# EAGLE schematic rev_l_v8 (EAGLE 9.7.0)
AUTHOR: Pat Pannuto; REV: L; TITLE: TotTag

## Sheet 1 of 5: nRF8240
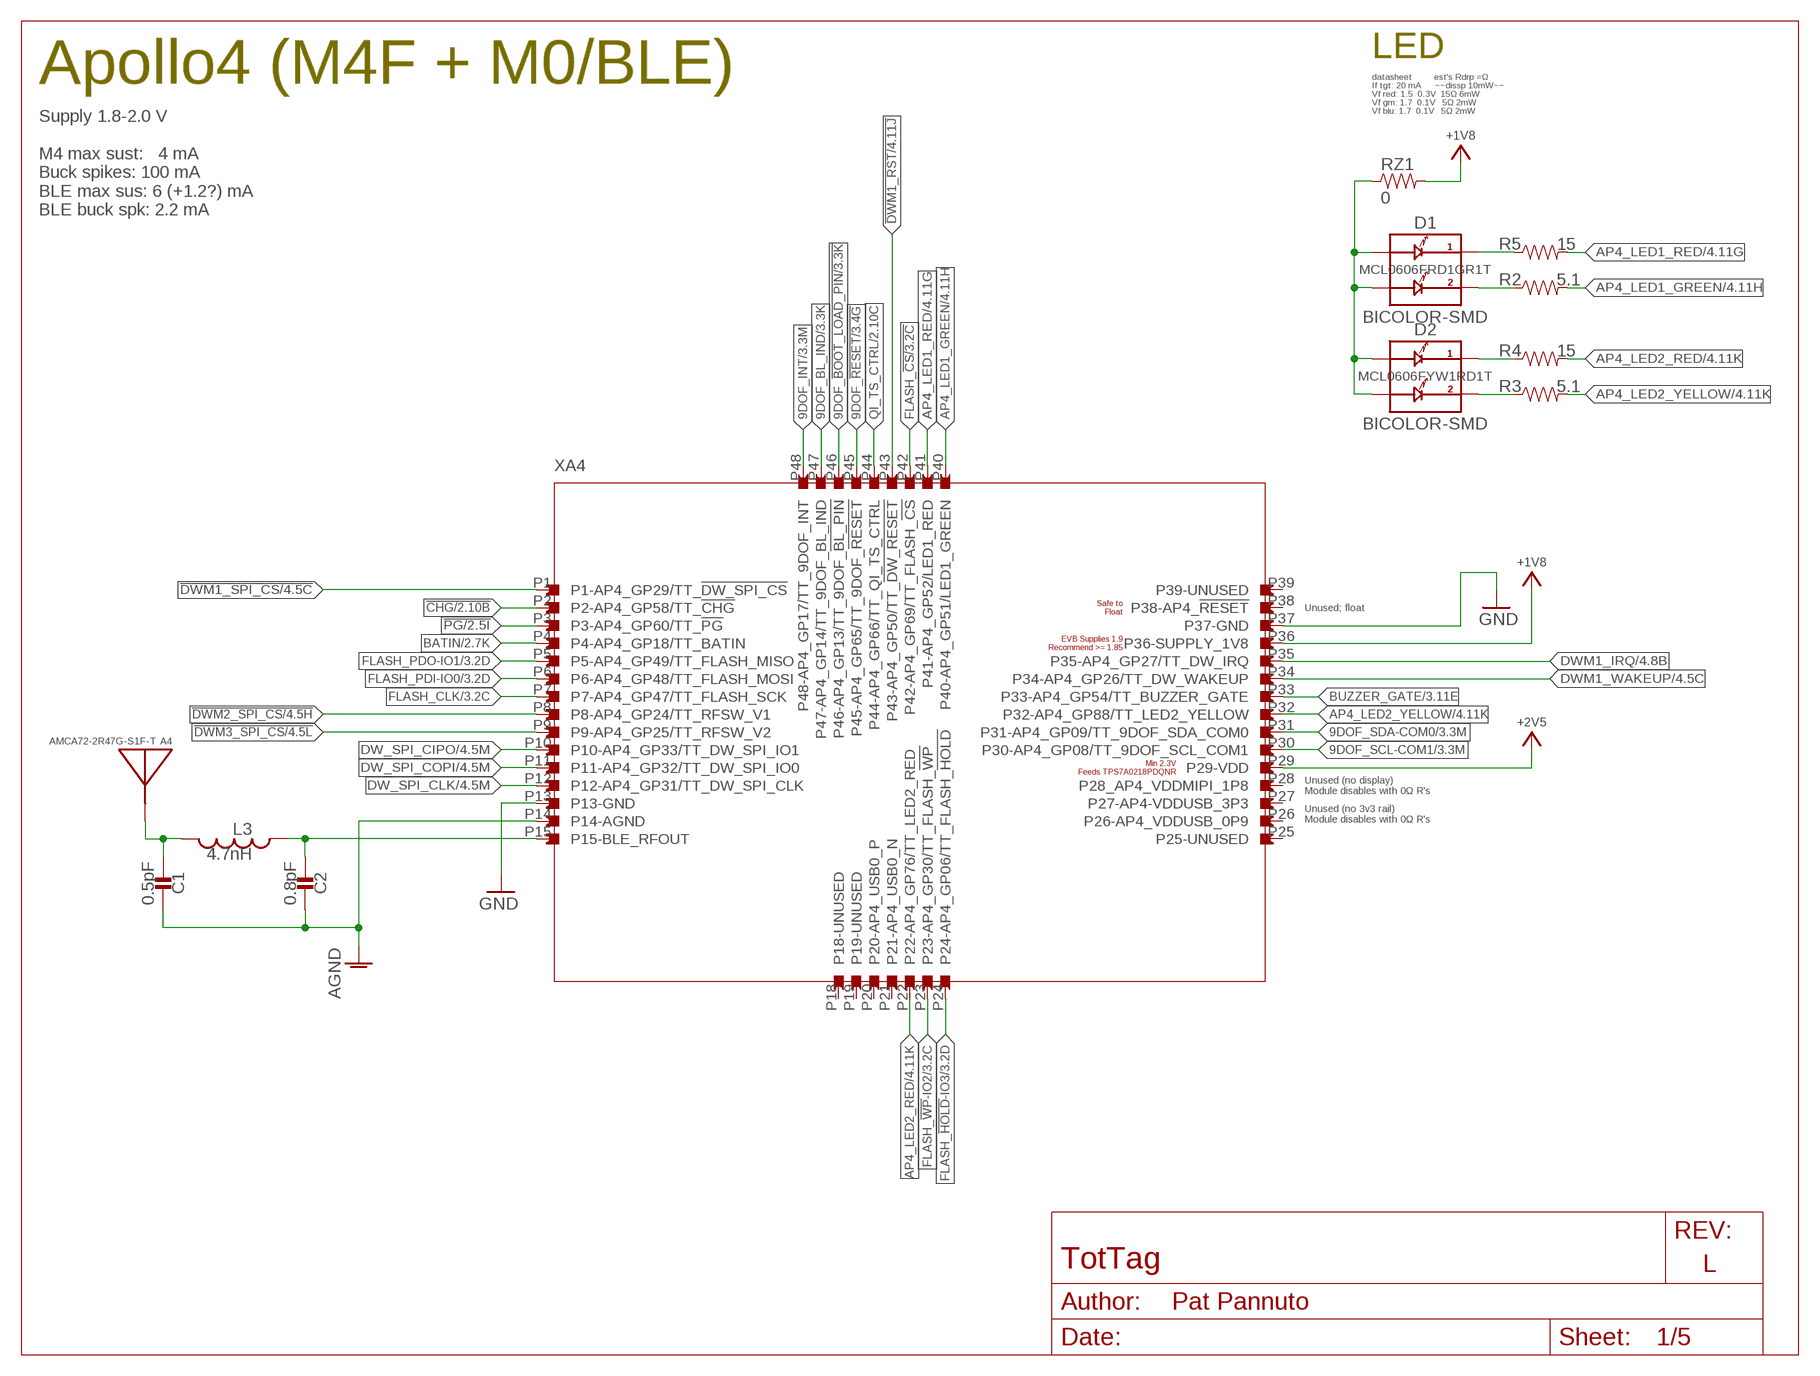
[diagram p0: schematic, sheet 1]

### Parts
A4  AMCA72-2R47G-S1F-T  [AMCA72-2R470G-S1F-T]
C1  0.5pF  CAPACITOR0402_CAP  [0402_CAP]
C2  0.8pF  CAPACITOR0402_CAP  [0402_CAP]
D1  BICOLOR-SMD  [LED-0606]
D2  BICOLOR-SMD  [LED-0606]
L3  4.7nH  INDUCTOR0402  [0402_CAP]
R2  5.1  RESISTOR0402_RES  [0402_RES]
R3  5.1  RESISTOR0402_RES  [0402_RES]
R4  15  RESISTOR0402_RES  [0402_RES]
R5  15  RESISTOR0402_RES  [0402_RES]
RZ1  0  RESISTOR0603_RES  [0603-RES]
XA4  APOLLO4_BLUEPLUS_MODULE  [APOLLO4_BLUEPLUS_MODULE]

### Nets
9DOF_!BOOT_LOAD_PIN: XA4.P46(P46-AP4_GP13/TT_9DOF_!BL_PIN) ; also sheet 3
9DOF_!RESET: XA4.P45(P45-AP4_GP65/TT_9DOF_!RESET) ; also sheet 3
9DOF_BL_IND: XA4.P47(P47-AP4_GP14/TT_9DOF_BL_IND) ; also sheet 3
9DOF_INT: XA4.P48(P48-AP4_GP17/TT_9DOF_INT) ; also sheet 3
9DOF_SCL-COM1: XA4.P30(P30-AP4_GP08/TT_9DOF_SCL_COM1) ; also sheet 3
9DOF_SDA-COM0: XA4.P31(P31-AP4_GP09/TT_9DOF_SDA_COM0) ; also sheet 3
!CHG: XA4.P2(P2-AP4_GP58/TT_!CHG) ; also sheet 2
!DWM1_RST: XA4.P43(P43-AP4_GP50/TT_!DW_RESET) ; also sheet 4
!DWM1_SPI_CS: XA4.P1(P1-AP4_GP29/TT_!DW_SPI_CS) ; also sheet 4
!DWM2_SPI_CS: XA4.P8(P8-AP4_GP24/TT_RFSW_V1) ; also sheet 4
!DWM3_SPI_CS: XA4.P9(P9-AP4_GP25/TT_RFSW_V2) ; also sheet 4
!PG: XA4.P3(P3-AP4_GP60/TT_!PG) ; also sheet 2
+1V8: RZ1.2 XA4.P36(P36-SUPPLY_1V8) ; also sheet 2,3,4
+2V5: XA4.P29(P29-VDD) ; also sheet 2,3,4
AGND [BLE_RF]: C1.2 C2.2 XA4.P14(P14-AGND)
AP4_LED1_GREEN: R2.2 XA4.P40(P40-AP4_GP51/LED1_GREEN) ; also sheet 4
AP4_LED1_RED: R5.2 XA4.P41(P41-AP4_GP52/LED1_RED) ; also sheet 4
AP4_LED2_BLUE_COMM: D1.C1 R5.1
AP4_LED2_RED: R4.2 XA4.P22(P22-AP4_GP76/TT_LED2_RED) ; also sheet 4
AP4_LED2_YELLOW: R3.2 XA4.P32(P32-AP4_GP88/TT_LED2_YELLOW) ; also sheet 4
AP4_LED_BLUE_COMM: D2.C2 R3.1
AP4_LED_GREEN_COMM: D2.C1 R4.1
AP4_LED_RED_COMM: D1.C2 R2.1
AP4_RFIOP [BLE_RF]: C2.1 L3.2 XA4.P15(P15-BLE_RFOUT)
BATIN: XA4.P4(P4-AP4_GP18/TT_BATIN) ; also sheet 2
BLE_ANT_FEED [BLE_RF]: A4.S1(ANTENNA) C1.1 L3.1
BUZZER_GATE: XA4.P33(P33-AP4_GP54/TT_BUZZER_GATE) ; also sheet 3
DW_SPI_CIPO: XA4.P10(P10-AP4_GP33/TT_DW_SPI_IO1) ; also sheet 4
DW_SPI_CLK: XA4.P12(P12-AP4_GP31/TT_DW_SPI_CLK) ; also sheet 4
DW_SPI_COPI: XA4.P11(P11-AP4_GP32/TT_DW_SPI_IO0) ; also sheet 4
DWM1_IRQ: XA4.P35(P35-AP4_GP27/TT_DW_IRQ) ; also sheet 4
DWM1_WAKEUP: XA4.P34(P34-AP4_GP26/TT_DW_WAKEUP) ; also sheet 4
FLASH_!CS: XA4.P42(P42-AP4_GP69/TT_FLASH_!CS) ; also sheet 3
FLASH_!HOLD!-IO3: XA4.P24(P24-AP4_GP06/TT_FLASH_!HOLD) ; also sheet 3
FLASH_!WP!-IO2: XA4.P23(P23-AP4_GP30/TT_FLASH_!WP) ; also sheet 3
FLASH_CLK: XA4.P7(P7-AP4_GP47/TT_FLASH_SCK) ; also sheet 3
FLASH_PDI-IO0: XA4.P6(P6-AP4_GP48/TT_FLASH_MOSI) ; also sheet 3
FLASH_PDO-IO1: XA4.P5(P5-AP4_GP49/TT_FLASH_MISO) ; also sheet 3
GND: XA4.P13(P13-GND) XA4.P37(P37-GND) ; also sheet 2,3,4
LED_SUP: D1.A1 D1.A2 D2.A1 D2.A2 RZ1.1
QI_TS_CTRL: XA4.P44(P44-AP4_GP66/TT_QI_TS_CTRL) ; also sheet 2
Unconnected: XA4.P18(P18-UNUSED) XA4.P19(P19-UNUSED) XA4.P20(P20-AP4_USB0_P) XA4.P21(P21-AP4_USB0_N) XA4.P25(P25-UNUSED) XA4.P26(P26-AP4_VDDUSB_0P9) XA4.P27(P27-AP4-VDDUSB_3P3) XA4.P28(P28_AP4_VDDMIPI_1P8) XA4.P38(P38-AP4_!RESET) XA4.P39(P39-UNUSED)

### Notes on the sheet
- Apollo4 (M4F + M0/BLE)
- LED
- datasheet          est's Rdrp =Ω
  If tgt: 20 mA      ~~dissp 10mW~~
  Vf red: 1.5  0.3V  15Ω 6mW
  Vf grn: 1.7  0.1V   5Ω 2mW
  Vf blu: 1.7  0.1V   5Ω 2mW
- Supply 1.8-2.0 V
  
  M4 max sust:   4 mA
  Buck spikes: 100 mA
  BLE max sus: 6 (+1.2?) mA
  BLE buck spk: 2.2 mA
- Unused; float
- Unused (no display)
  Module disables with 0Ω R's
- Unused (no 3v3 rail)
  Module disables with 0Ω R's

## Sheet 2 of 5: Power
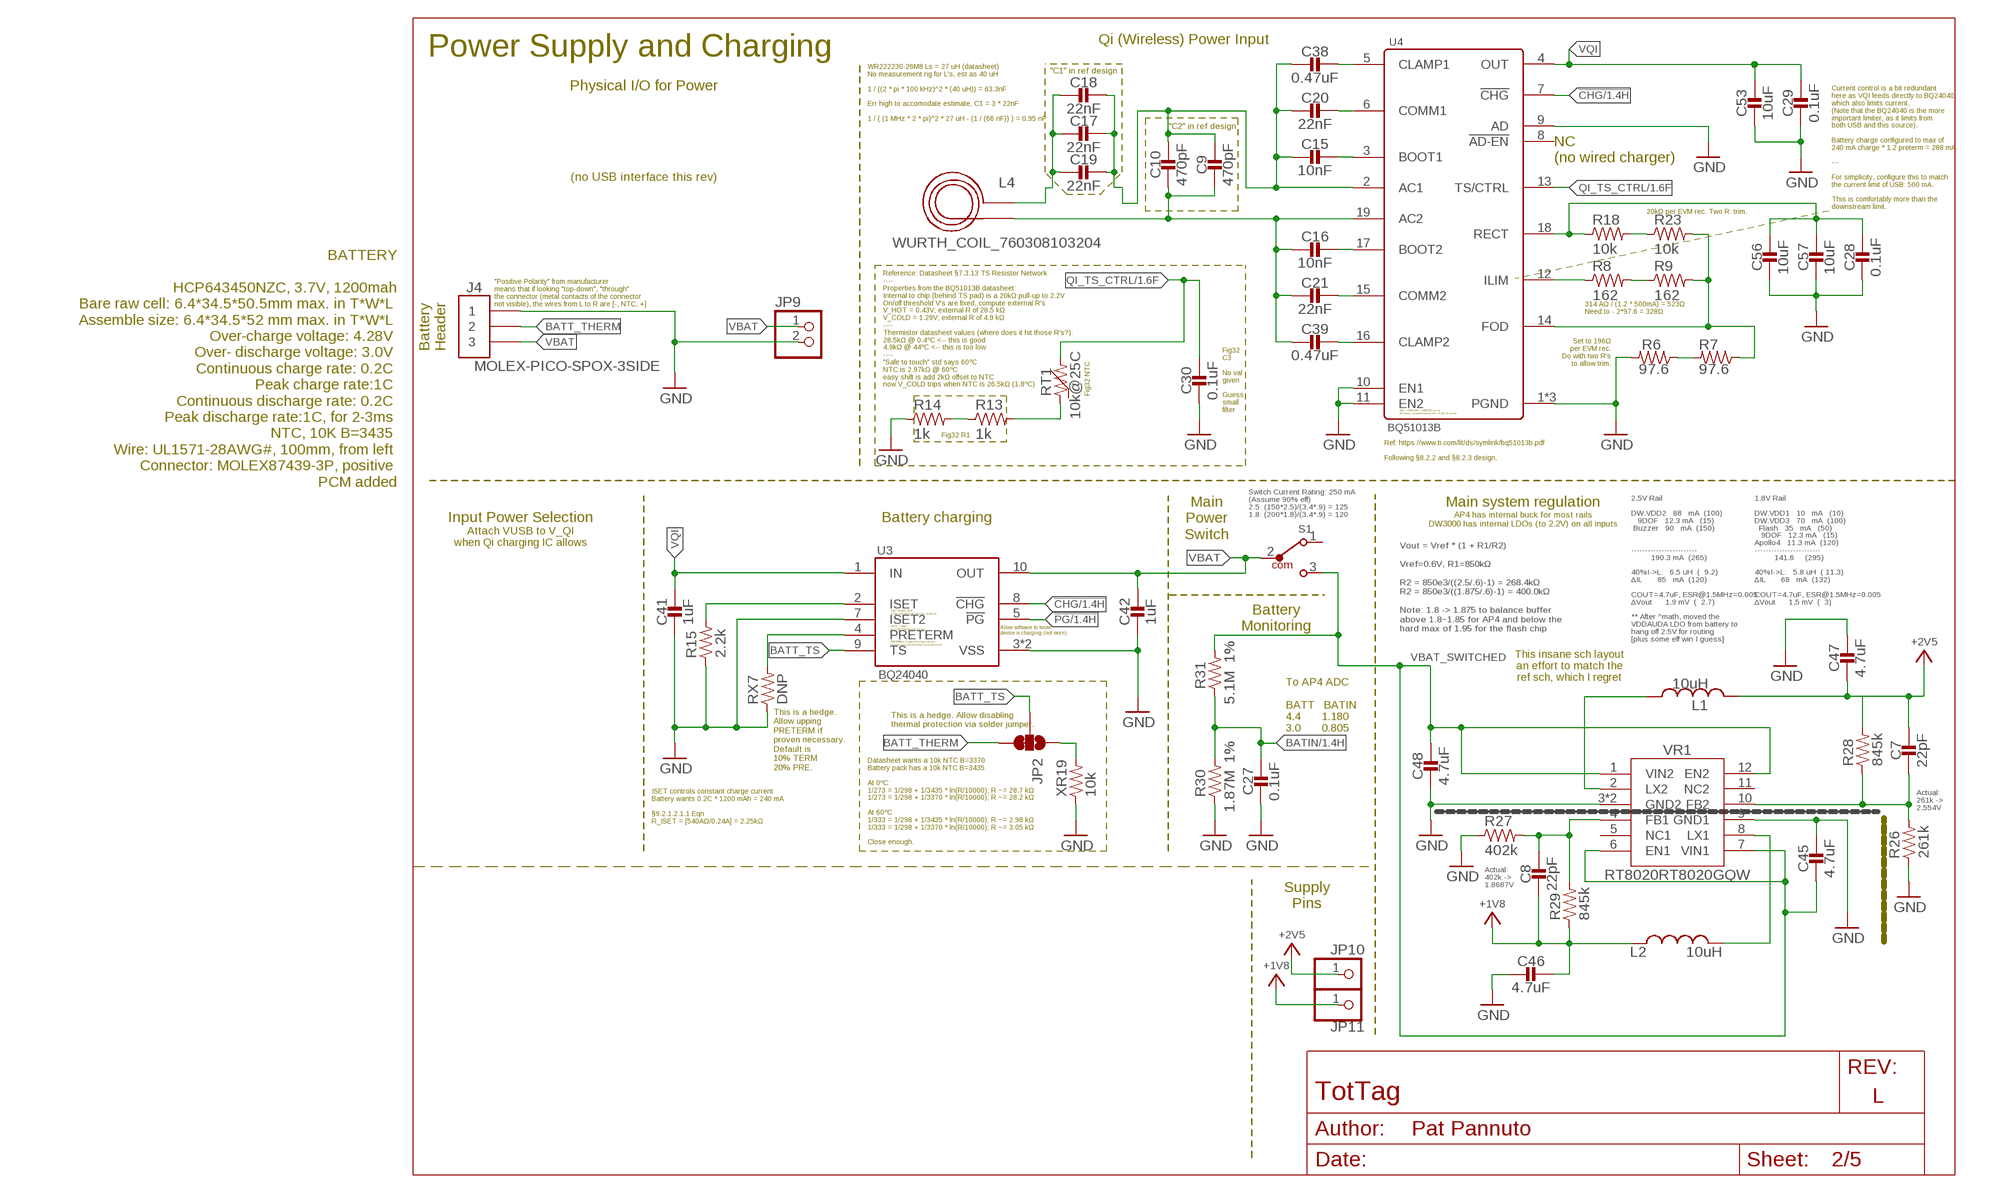
[diagram p1: schematic, sheet 2]

### Parts
C7  22pF  CAPACITOR0201_CAP  [0201_CAP]
C8  22pF  CAPACITOR0201_CAP  [0201_CAP]
C9  470pF  CAPACITOR0402_CAP  [0402_CAP]
C10  470pF  CAPACITOR0402_CAP  [0402_CAP]
C15  10nF  CAPACITOR0402_CAP  [0402_CAP]
C16  10nF  CAPACITOR0402_CAP  [0402_CAP]
C17  22nF  CAPACITOR0402_CAP  [0402_CAP]
C18  22nF  CAPACITOR0402_CAP  [0402_CAP]
C19  22nF  CAPACITOR0402_CAP  [0402_CAP]
C20  22nF  CAPACITOR0402_CAP  [0402_CAP]
C21  22nF  CAPACITOR0402_CAP  [0402_CAP]
C27  0.1uF  CAPACITOR0402_CAP  [0402_CAP]
C28  0.1uF  CAPACITOR0402_CAP  [0402_CAP]
C29  0.1uF  CAPACITOR0402_CAP  [0402_CAP]
C30  0.1uF  CAPACITOR0402_CAP  [0402_CAP]
C38  0.47uF  CAPACITOR0402_CAP  [0402_CAP]
C39  0.47uF  CAPACITOR0402_CAP  [0402_CAP]
C41  1uF  CAPACITOR0402_CAP  [0402_CAP]
C42  1uF  CAPACITOR0402_CAP  [0402_CAP]
C45  4.7uF  CAPACITOR0603_CAP  [0603_CAP]
C46  4.7uF  CAPACITOR0603_CAP  [0603_CAP]
C47  4.7uF  CAPACITOR0603_CAP  [0603_CAP]
C48  4.7uF  CAPACITOR0603_CAP  [0603_CAP]
C53  10uF  CAPACITOR0603_CAP  [0603_CAP]
C56  10uF  CAPACITOR0603_CAP  [0603_CAP]
C57  10uF  CAPACITOR0603_CAP  [0603_CAP]
J4  MOLEX-PICO-SPOX-3SIDE  [MOLEX-PICO-SPOX-3_SIDE]
JP2  JUMPER-SMT_3_1-NC_TRACE_SILK  [SMT-JUMPER_3_1-NC_TRACE_SILK]
JP9  PINHD-1X2  [1X02]
JP10  PINHD-1X1  [1X01]
JP11  PINHD-1X1  [1X01]
L1  10uH  INDUCTORNRX3015  [NRX3015]
L2  10uH  INDUCTORNRX3015  [NRX3015]
L4  WURTH_COIL_760308103204  [WURTH_COIL_760308103204]
R6  97.6  RESISTOR0402_RES  [0402_RES]
R7  97.6  RESISTOR0402_RES  [0402_RES]
R8  162  RESISTOR0402_RES  [0402_RES]
R9  162  RESISTOR0402_RES  [0402_RES]
R13  1k  RESISTOR0402_RES  [0402_RES]
R14  1k  RESISTOR0402_RES  [0402_RES]
R15  2.2k  RESISTOR0402_RES  [0402_RES]
R18  10k  RESISTOR0402_RES  [0402_RES]
R23  10k  RESISTOR0402_RES  [0402_RES]
R26  261k  RESISTOR0201_RES  [0201_RES]
R27  402k  RESISTOR0201_RES  [0201_RES]
R28  845k  RESISTOR0201_RES  [0201_RES]
R29  845k  RESISTOR0201_RES  [0201_RES]
R30  1.87M  RESISTOR0402_RES  [0402_RES]
R31  5.1M  RESISTOR0402_RES  [0402_RES]
RT1  10k@25C  THERMISTOR0402  [0402_RES]
RX7  DNP  RESISTOR0402_RES  [0402_RES]
S1  450404015514  [450404015514]
U3  BQ24040  [DSQ0010A]
U4  BQ51013B  [RHL0020A]
VR1  RT8020RT8020GQW  [SON45P300X300X80-13T160X250N]
XR19  10k  RESISTOR0402_RES  [0402_RES]

### Nets
!CHG: U3.8(!CHG) U4.7(!CHG) ; also sheet 1
!PG: U3.5(!PG) ; also sheet 1
+1V8: C8.P$2 C46.1 JP11.1 L2.P$1 R29.1 ; also sheet 1,3,4
+2V5: C7.P$1 C47.2 JP10.1 L1.P$2 R28.2 ; also sheet 1,3,4
BATIN: C27.1 R30.2 R31.1 ; also sheet 1
BATT_THERM: J4.2 J4.2SUPP JP2.3
BATT_TS: JP2.2 U3.9(TS)
BQ_AC1: C9.1 C10.1 C15.2 C17.1 C18.1 C19.1 C20.2 C38.2 U4.2(AC1)
BQ_AC2: C9.2 C10.2 C16.2 C21.2 C39.2 L4.P$2 U4.19(AC2)
BQ_BOOT1: C15.1 U4.3(BOOT1)
BQ_BOOT2: C16.1 U4.17(BOOT2)
BQ_CLAMP1: C38.1 U4.5(CLAMP1)
BQ_CLAMP2: C39.1 U4.16(CLAMP2)
BQ_COMM1: C20.1 U4.6(COMM1)
BQ_COMM2: C21.1 U4.15(COMM2)
BQ_FOD: R7.1 R9.2 R23.2 U4.14(FOD)
BQ_ILM: R8.1 U4.12(ILIM)
BQ_ISET: R15.2 U3.2(ISET)
BQ_RECT: C28.1 C56.1 C57.1 R18.1 U4.18(RECT)
COIL_AC1: C17.2 C18.2 C19.2 L4.P$1
GND: C27.2 C28.2 C29.2 C30.2 C41.2 C42.2 C45.1 C46.2 C47.1 C48.2 C53.2 C56.2 C57.2 J4.1 J4.1SUPP JP9.2 R6.2 R14.1 R15.1 R26.1 R27.1 R30.1 RX7.1 U3.3(VSS) U3.7(ISET2) U3.PAD(VSS) U4.1(PGND) U4.9(AD) U4.10(EN1) U4.11(EN2) U4.20(PGND) U4.PAD(PGND) VR1.3(GND2) VR1.9(GND1) VR1.13(GND2) XR19.1 ; also sheet 1,3,4
N$28: R6.1 R7.2
N$47: JP2.1 XR19.2
N$49: RX7.2 U3.4(PRETERM)
N$64: R18.2 R23.1
N$66: R8.2 R9.1
N$69: R13.2 RT1.1
N$70: R13.1 R14.2
QI_TS_CTRL: C30.1 RT1.2 U4.13(TS/CTRL) ; also sheet 1
VBAT: C42.1 J4.3 J4.3SUPP JP9.1 S1.2 U3.10(OUT)
VBAT_SWITCHED: C45.2 C48.1 R31.2 S1.3 VR1.1(VIN2) VR1.6(EN1) VR1.7(VIN1) VR1.12(EN2) ; also sheet 3
VQI: C29.1 C41.1 C53.1 U3.1(IN) U4.4(OUT)
VR1_FB1: C8.P$1 R27.2 R29.2 VR1.4(FB1)
VR1_FB2: C7.P$2 R26.2 R28.1 VR1.10(FB2)
VR1_LX1: L2.P$2 VR1.8(LX1)
VR1_LX2: L1.P$1 VR1.2(LX2)
Unconnected: S1.1 U4.8(!AD-EN) VR1.5(NC1) VR1.11(NC2)

### Notes on the sheet
- Power Supply and Charging | Qi (Wireless) Power Input
- WR222230-26M8 Ls = 27 uH (datasheet)
  No measurement rig for L's, est as 40 uH
  
  1 / ((2 * pi * 100 kHz)^2 * (40 uH)) = 63.3nF
  
  Err high to accomodate estimate, C1 = 3 * 22nF
  
  1 / ( (1 MHz * 2 * pi)^2 * 27 uH - (1 / (66 nF)) ) = 0.95 nF
- "C1" in ref design
- Physical I/O for Power
- "C2" in ref design
- NC
  (no wired charger)
- (no USB interface this rev)
- 20kΩ per EVM rec. Two R: trim.
- Current control is a bit redundant
  here as VQI feeds directly to BQ24040,
  which also limits current.
  (Note that the BQ24040 is the more
  important limiter, as it limits from
  both USB and this source).
  
  Battery charge configured to max of
  240 mA charge * 1.2 preterm = 288 mA.
  
  ---
  
  For simplicity, configure this to match
  the current limit of USB: 500 mA.
  
  This is comfortably more than the
  downstream limit.
- BATTERY
  
  HCP643450NZC, 3.7V, 1200mah
  Bare raw cell: 6.4*34.5*50.5mm max. in T*W*L 
  Assemble size: 6.4*34.5*52 mm max. in T*W*L 
  Over-charge voltage: 4.28V 
  Over- discharge voltage: 3.0V 
  Continuous charge rate: 0.2C 
  Peak charge rate:1C 
  Continuous discharge rate: 0.2C 
  Peak discharge rate:1C, for 2-3ms 
  NTC, 10K B=3435 
  Wire: UL1571-28AWG#, 100mm, from left 
  Connector: MOLEX87439-3P, positive 
  PCM added
- Reference: Datasheet §7.3.13 TS Resistor Network
  ----
  Properties from the BQ51013B datasheet:
  Internal to chip (behind TS pad) is a 20kΩ pull-up to 2.2V
  On/off threshold V's are fixed, compute external R's
  V_HOT = 0.43V; external R of 28.5 kΩ
  V_COLD = 1.29V; external R of 4.9 kΩ
  ----
  Thermistor datasheet values (where does it hit those R's?):
  28.5kΩ @ 0.4ºC <-- this is good
  4.9kΩ @ 44ºC <-- this is too low
  ----
  "Safe to touch" std says 60ºC
  NTC is 2.97kΩ @ 60ºC
  easy shift is add 2kΩ offset to NTC
  now V_COLD trips when NTC is 26.5kΩ (1.8ºC)
- 314 AΩ / (1.2 * 500mA) = 523Ω
  Need to - 2*97.6 = 328Ω
- "Positive Polarity" from manufacturer
  means that if looking "top-down", "through"
  the connector (metal contacts of the connector
  not visible), the wires from L to R are [-, NTC, +]
- Battery
  Header
- Set to 196Ω
  per EVM rec.
  Do with two R's
  to allow trim.
- Fig32
  C3
  
  No val
  given
  
  Guess
  small
  filter
- Fig32 NTC
- EN1 -> GND, EN2 -> GND [00 case]
  Wireless enabled unless AD > V_AD_Present
- Fig32 R1
- Ref: https://www.ti.com/lit/ds/symlink/bq51013b.pdf
  
  Following §8.2.2 and §8.2.3 design.
- Switch Current Rating: 250 mA
  (Assume 90% eff)
  2.5: (150*2.5)/(3.4*.9) = 125
  1.8: (200*1.8)/(3.4*.9) = 120
- Main
  Power
  Switch
- Main system regulation
- 2.5V Rail
  
  DW.VDD2   88   mA  (100)
     9DOF   12.3 mA   (15)
   Buzzer   90   mA  (150)
  
  
  ------------------------
           190.3 mA  (265)
  
  40%I->L:   6.5 uH  (  9.2)
  ∆IL       85   mA  (120)
  
  COUT=4.7uF, ESR@1.5MHz=0.005
  ∆Vout      1.9 mV  (  2.7)
  
  ** After ^math, moved the
  VDDAUDA LDO from battery to
  hang off 2.5V for routing
  [plus some eff win I guess]
- 1.8V Rail
  
  DW.VDD1   10   mA   (10)
  DW.VDD3   70   mA  (100)
    Flash   35   mA   (50)
     9DOF   12.3 mA   (15)
  Apollo4   11.3 mA  (120)
  ------------------------
           141.6     (295)
  
  40%I->L:   5.8 uH  ( 11.3)
  ∆IL       68   mA  (132)
  
  COUT=4.7uF, ESR@1.5MHz=0.005
  ∆Vout      1.5 mV  (  3)
- Input Power Selection | Battery charging
- AP4 has internal buck for most rails
  DW3000 has internal LDOs (to 2.2V) on all inputs
- Attach VUSB to V_QI
  when Qi charging IC allows
- Vout = Vref * (1 + R1/R2)
  
  Vref=0.6V, R1=850kΩ
  
  R2 = 850e3/((2.5/.6)-1) = 268.4kΩ
  R2 = 850e3/((1.875/.6)-1) = 400.0kΩ
  
  Note: 1.8 -> 1.875 to balance buffer
  above 1.8~1.85 for AP4 and below the
  hard max of 1.95 for the flash chip
- Battery
  Monitoring
- ISET = KISET / IOUT
  2.25k = 540 AΩ / 240 mA; 2.2k -> 245 mA
- ISET2 -> GND
  Use ISET to limit input current
- Allow software to know
  device is charging (not worn)
- PRETERM is %age of charge current
  system uses when battery is totally dead
- This insane sch layout
  an effort to match the
  ref sch, which I regret
- This is a hedge.
  Allow upping
  PRETERM if
  proven necessary.
  Default is
  10% TERM
  20% PRE.
- This is a hedge. Allow disabling
  thermal protection via solder jumper.
- To AP4 ADC
  
  BATT   BATIN
  4.4       1.180
  3.0       0.805
- Datasheet wants a 10k NTC B=3370
  Battery pack has a 10k NTC B=3435
  
  At 0ºC:
  1/273 = 1/298 + 1/3435 * ln(R/10000); R ~= 28.7 kΩ
  1/273 = 1/298 + 1/3370 * ln(R/10000); R ~= 28.2 kΩ
  
  At 60ºC
  1/333 = 1/298 + 1/3435 * ln(R/10000); R ~= 2.98 kΩ
  1/333 = 1/298 + 1/3370 * ln(R/10000); R ~= 3.05 kΩ
  
  Close enough.
- ISET controls constant charge current
  Battery wants 0.2C * 1200 mAh = 240 mA
  
  §9.2.1.2.1.1 Eqn
  R_ISET = [540AΩ/0.24A] = 2.25kΩ
- Actual:
  261k ->
  2.554V
- Actual:
  402k ->
  1.8687V
- Supply
  Pins

## Sheet 3 of 5: SD Card + Sensors
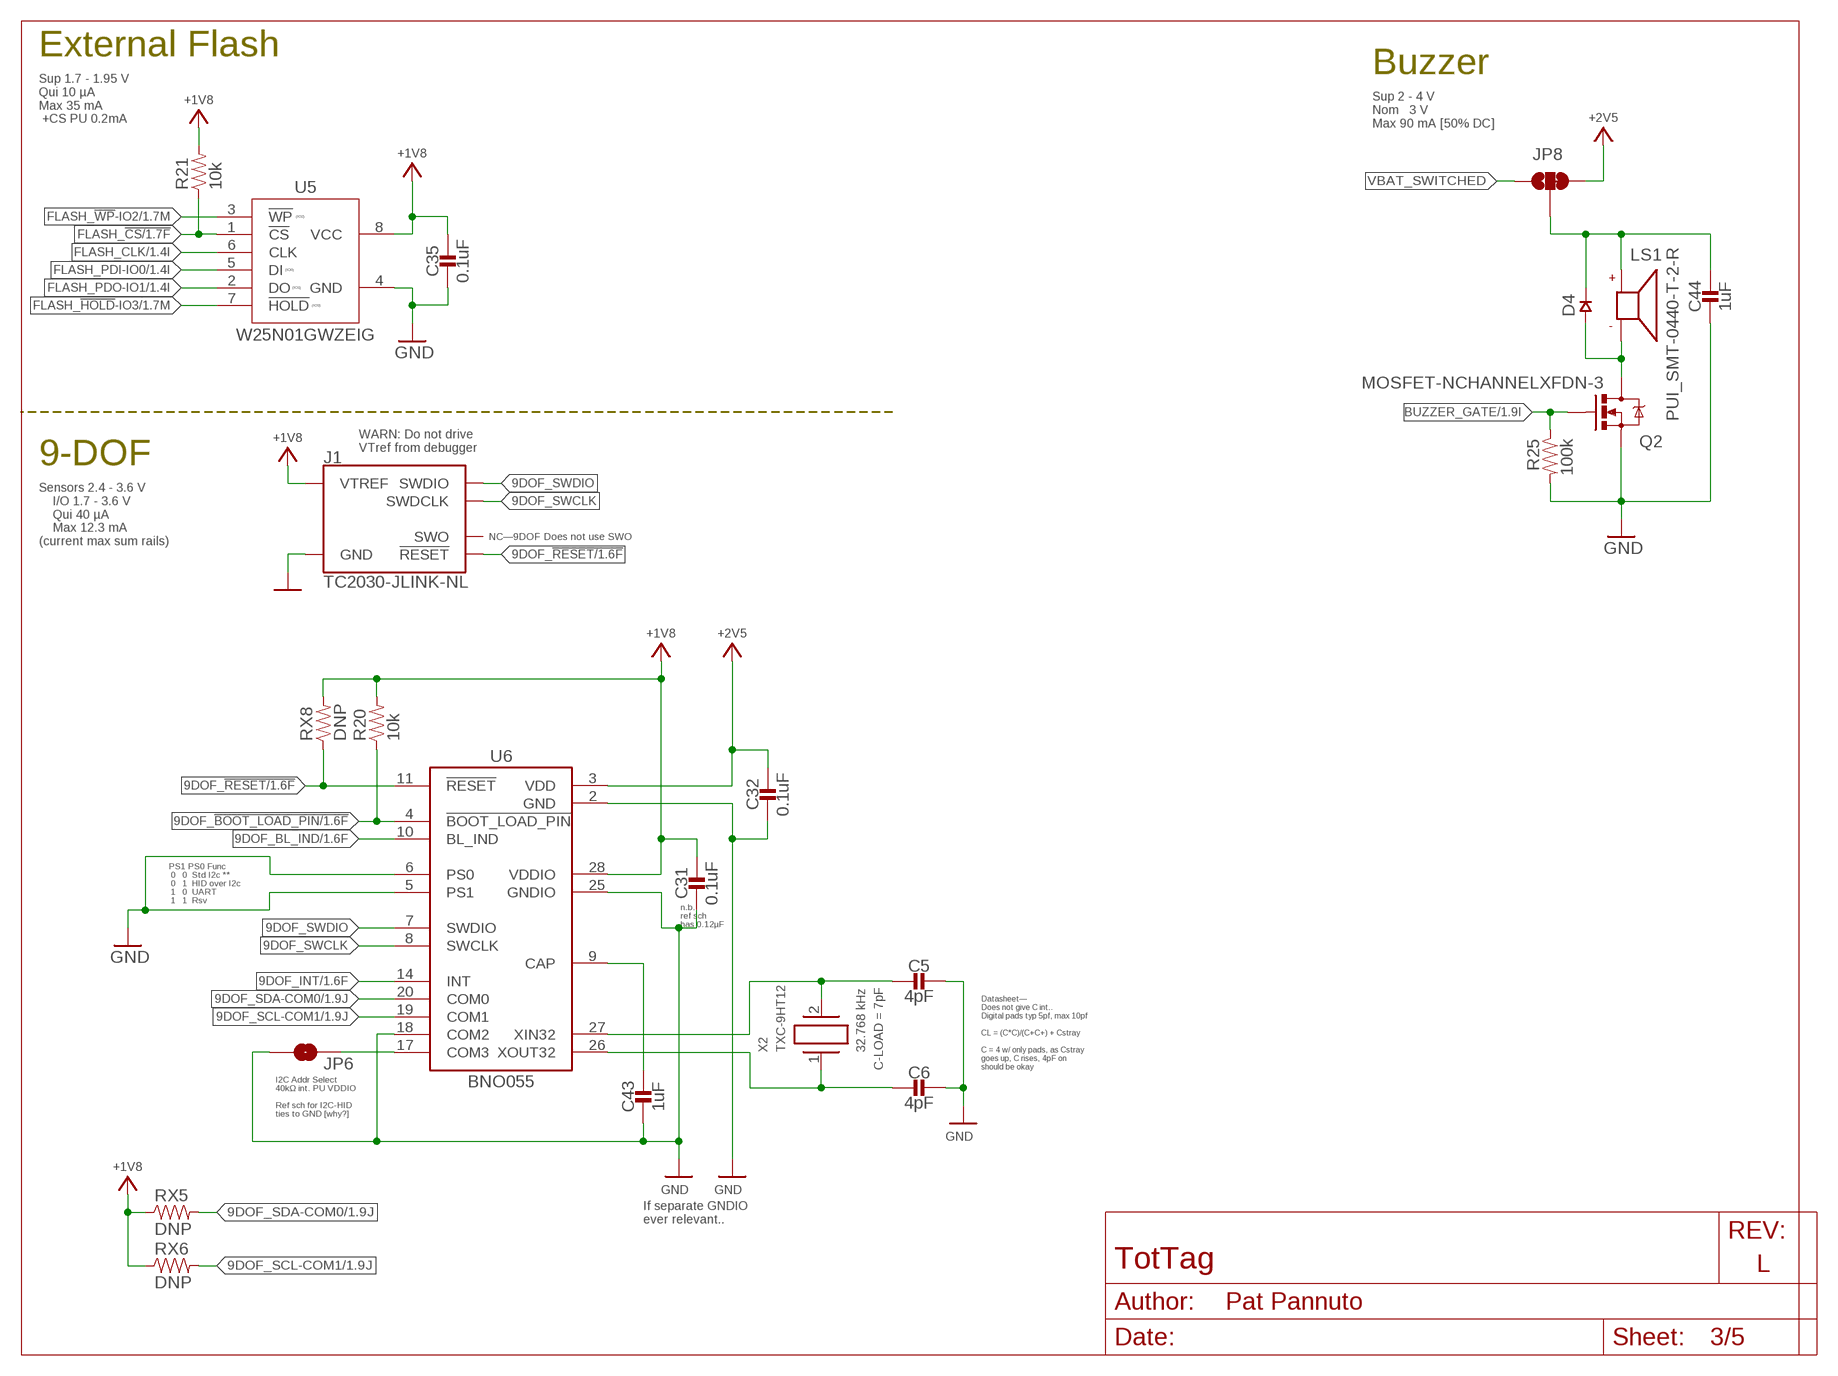
[diagram p2: schematic, sheet 3]

### Parts
C5  4pF  CAPACITOR0201_CAP  [0201_CAP]
C6  4pF  CAPACITOR0201_CAP  [0201_CAP]
C31  0.1uF  CAPACITOR0402_CAP  [0402_CAP]
C32  0.1uF  CAPACITOR0402_CAP  [0402_CAP]
C35  0.1uF  CAPACITOR0402_CAP  [0402_CAP]
C43  1uF  CAPACITOR0402_CAP  [0402_CAP]
C44  1uF  CAPACITOR0402_CAP  [0402_CAP]
D4  DIODE0402  [0402_DIODE]
J1  TC2030-JLINK-NL  [TC2030-IDC-NL]
JP6  JUMPER-SMT_2_NO_SILK  [SMT-JUMPER_2_NO_SILK]
JP8  JUMPER-SMT_3_1-NC_TRACE_SILK  [SMT-JUMPER_3_1-NC_TRACE_SILK]
LS1  PUI_SMT-0440-T-2-R  [SMT-0440-T-2-R]
Q2  MOSFET-NCHANNELXFDN-3  [XFDFN-3]
R20  10k  RESISTOR0402_RES  [0402_RES]
R21  10k  RESISTOR0402_RES  [0402_RES]
R25  100k  RESISTOR0402_RES  [0402_RES]
RX5  DNP  RESISTOR0603_RES  [0603-RES]
RX6  DNP  RESISTOR0603_RES  [0603-RES]
RX8  DNP  RESISTOR0603_RES  [0603-RES]
U5  W25N01GWZEIG  [WSON127P800X600X80-9T430X340N]
U6  BNO055  [LGA28R0P510X4_5P2X3P8X1]
X2  TXC-9HT12  [TXC-9HT12]

### Nets
9DOF_!BOOT_LOAD_PIN: R20.1 U6.4(!BOOT_LOAD_PIN) ; also sheet 1
9DOF_!RESET: J1.3(!RESET) RX8.1 U6.11(!RESET) ; also sheet 1
9DOF_BL_IND: U6.10(BL_IND) ; also sheet 1
9DOF_CAP: C43.1 U6.9(CAP)
9DOF_INT: U6.14(INT) ; also sheet 1
9DOF_SCL-COM1: RX6.2 U6.19(COM1) ; also sheet 1
9DOF_SDA-COM0: RX5.2 U6.20(COM0) ; also sheet 1
9DOF_SWCLK: J1.4(SWDCLK) U6.8(SWCLK)
9DOF_SWDIO: J1.2(SWDIO) U6.7(SWDIO)
9DOF_XI: C5.P$2 U6.27(XIN32) X2.2
9DOF_XO: C6.P$2 U6.26(XOUT32) X2.1
+1V8: C31.1 C35.1 J1.1(VTREF) R20.2 R21.2 RX5.1 RX6.1 RX8.2 U5.8(VCC) U6.28(VDDIO) ; also sheet 1,2,4
+2V5: C32.1 JP8.3 U6.3(VDD) ; also sheet 1,2,4
BUZZER_GATE: Q2.G R25.1 ; also sheet 1
BUZZER_SUPPLY: C44.1 D4.CATHODE JP8.2 LS1.+(P)
FLASH_!CS: R21.1 U5.1(!CS) ; also sheet 1
FLASH_!HOLD!-IO3: U5.7(!HOLD) ; also sheet 1
FLASH_!WP!-IO2: U5.3(!WP) ; also sheet 1
FLASH_CLK: U5.6(CLK) ; also sheet 1
FLASH_PDI-IO0: U5.5(DI) ; also sheet 1
FLASH_PDO-IO1: U5.2(DO) ; also sheet 1
GND: C5.P$1 C6.P$1 C31.2 C32.2 C35.2 C43.2 C44.2 J1.5(GND) JP6.1 Q2.S R25.2 U5.4(GND) U6.2(GND) U6.5(PS1) U6.6(PS0) U6.18(COM2) U6.25(GNDIO) ; also sheet 1,2,4
N$2: D4.ANODE LS1.-(N) Q2.D
N$42: JP6.2 U6.17(COM3)
VBAT_SWITCHED: JP8.1 ; also sheet 2
Unconnected: J1.6(SWO)

### Notes on the sheet
- External Flash
- Sup 1.7 - 1.95 V
  Qui 10 µA
  Max 35 mA
   +CS PU 0.2mA
- Buzzer
- Sup 2 - 4 V
  Nom   3 V
  Max 90 mA [50% DC]
- WARN: Do not drive
  VTref from debugger
- 9-DOF
- Sensors 2.4 - 3.6 V
      I/O 1.7 - 3.6 V
      Qui 40 µA
      Max 12.3 mA
  (current max sum rails)
- NC—9DOF Does not use SWO
- PS1 PS0 Func
   0   0  Std I2c **
   0   1  HID over I2c
   1   0  UART
   1   1  Rsv
- n.b.
  ref sch
  has 0.12µF
- Datasheet—
  Does not give C int..
  Digital pads typ 5pf, max 10pf
  
  CL = (C*C)/(C+C+) + Cstray
  
  C = 4 w/ only pads, as Cstray
  goes up, C rises, 4pF on
  should be okay
- I2C Addr Select
  40kΩ int. PU VDDIO
  
  Ref sch for I2C-HID
  ties to GND [why?]
- If separate GNDIO
  ever relevant..

## Sheet 4 of 5: Localization module
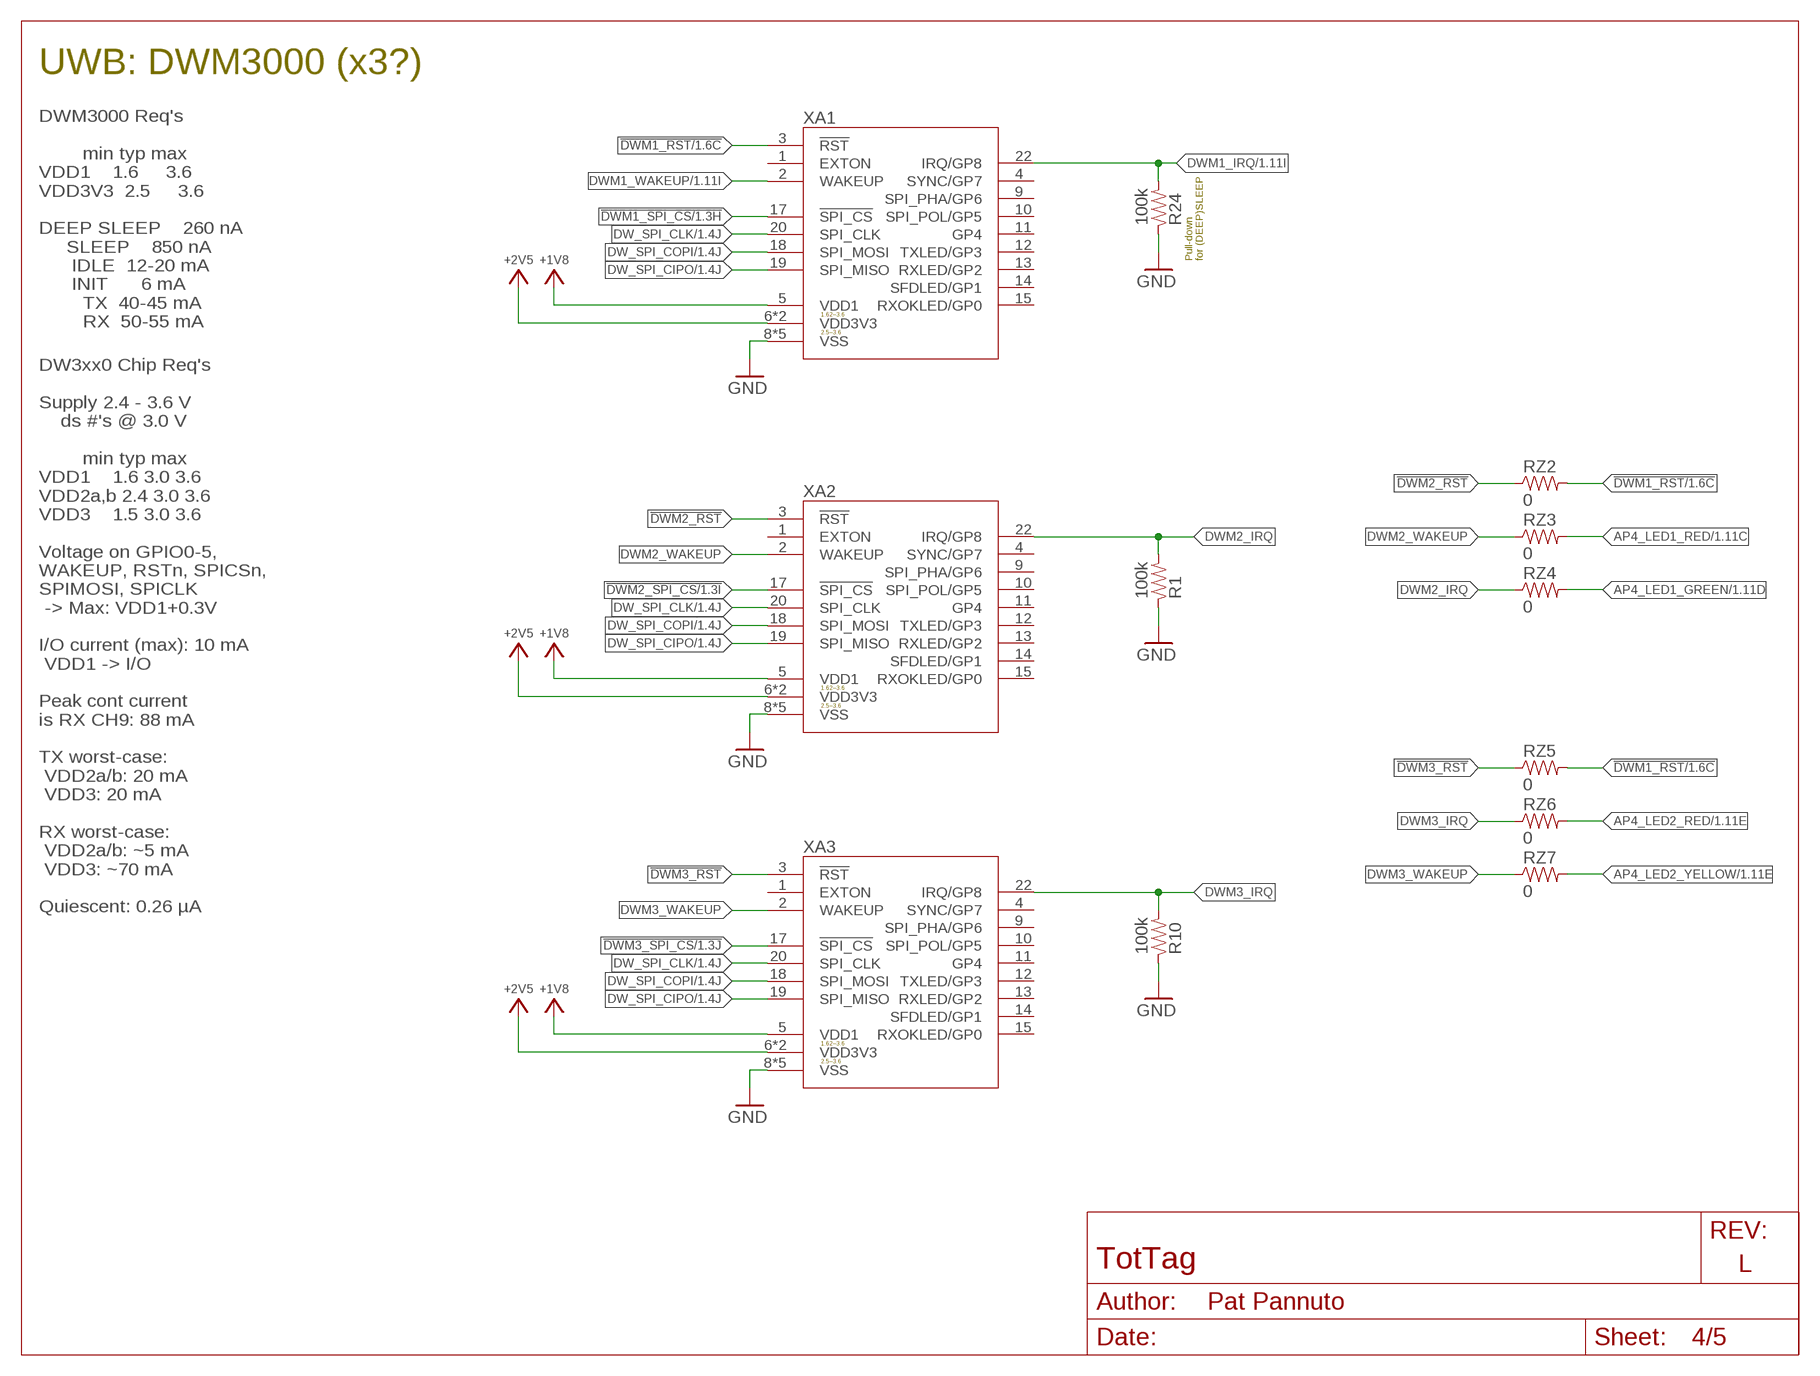
[diagram p3: schematic, sheet 4]

### Parts
R1  100k  RESISTOR0402_RES  [0402_RES]
R10  100k  RESISTOR0402_RES  [0402_RES]
R24  100k  RESISTOR0402_RES  [0402_RES]
RZ2  0  RESISTOR0603_RES  [0603-RES]
RZ3  0  RESISTOR0603_RES  [0603-RES]
RZ4  0  RESISTOR0603_RES  [0603-RES]
RZ5  0  RESISTOR0603_RES  [0603-RES]
RZ6  0  RESISTOR0603_RES  [0603-RES]
RZ7  0  RESISTOR0603_RES  [0603-RES]
XA1  DWM3000  [DWM3000]
XA2  DWM3000  [DWM3000]
XA3  DWM3000  [DWM3000]

### Nets
!DWM1_RST: RZ2.2 RZ5.2 XA1.3(!RST) ; also sheet 1
!DWM1_SPI_CS: XA1.17(!SPI_CS) ; also sheet 1
!DWM2_RST: RZ2.1 XA2.3(!RST)
!DWM2_SPI_CS: XA2.17(!SPI_CS) ; also sheet 1
!DWM3_RST: RZ5.1 XA3.3(!RST)
!DWM3_SPI_CS: XA3.17(!SPI_CS) ; also sheet 1
+1V8: XA1.5(VDD1) XA2.5(VDD1) XA3.5(VDD1) ; also sheet 1,2,3
+2V5: XA1.6(VDD3V3) XA1.7(VDD3V3) XA2.6(VDD3V3) XA2.7(VDD3V3) XA3.6(VDD3V3) XA3.7(VDD3V3) ; also sheet 1,2,3
AP4_LED1_GREEN: RZ4.2 ; also sheet 1
AP4_LED1_RED: RZ3.2 ; also sheet 1
AP4_LED2_RED: RZ6.2 ; also sheet 1
AP4_LED2_YELLOW: RZ7.2 ; also sheet 1
DW_SPI_CIPO: XA1.19(SPI_MISO) XA2.19(SPI_MISO) XA3.19(SPI_MISO) ; also sheet 1
DW_SPI_CLK: XA1.20(SPI_CLK) XA2.20(SPI_CLK) XA3.20(SPI_CLK) ; also sheet 1
DW_SPI_COPI: XA1.18(SPI_MOSI) XA2.18(SPI_MOSI) XA3.18(SPI_MOSI) ; also sheet 1
DWM1_IRQ: R24.2 XA1.22(IRQ/GP8) ; also sheet 1
DWM1_WAKEUP: XA1.2(WAKEUP) ; also sheet 1
DWM2_IRQ: R1.2 RZ4.1 XA2.22(IRQ/GP8)
DWM2_WAKEUP: RZ3.1 XA2.2(WAKEUP)
DWM3_IRQ: R10.2 RZ6.1 XA3.22(IRQ/GP8)
DWM3_WAKEUP: RZ7.1 XA3.2(WAKEUP)
GND: R1.1 R10.1 R24.1 XA1.8(VSS) XA1.16(VSS) XA1.21(VSS) XA1.23(VSS) XA1.24(VSS) XA2.8(VSS) XA2.16(VSS) XA2.21(VSS) XA2.23(VSS) XA2.24(VSS) XA3.8(VSS) XA3.16(VSS) XA3.21(VSS) XA3.23(VSS) XA3.24(VSS) ; also sheet 1,2,3
Unconnected: XA1.1(EXTON) XA1.4(SYNC/GP7) XA1.9(SPI_PHA/GP6) XA1.10(SPI_POL/GP5) XA1.11(GP4) XA1.12(TXLED/GP3) XA1.13(RXLED/GP2) XA1.14(SFDLED/GP1) XA1.15(RXOKLED/GP0) XA2.1(EXTON) XA2.4(SYNC/GP7) XA2.9(SPI_PHA/GP6) XA2.10(SPI_POL/GP5) XA2.11(GP4) XA2.12(TXLED/GP3) XA2.13(RXLED/GP2) XA2.14(SFDLED/GP1) XA2.15(RXOKLED/GP0) XA3.1(EXTON) XA3.4(SYNC/GP7) XA3.9(SPI_PHA/GP6) XA3.10(SPI_POL/GP5) XA3.11(GP4) XA3.12(TXLED/GP3) XA3.13(RXLED/GP2) XA3.14(SFDLED/GP1) XA3.15(RXOKLED/GP0)

### Notes on the sheet
- UWB: DWM3000 (x3?)
- DWM3000 Req's
  
          min typ max
  VDD1    1.6     3.6
  VDD3V3  2.5     3.6
  
  DEEP SLEEP    260 nA
       SLEEP    850 nA
        IDLE  12-20 mA
        INIT      6 mA
          TX  40-45 mA
          RX  50-55 mA
- Pull-down
  for (DEEP)SLEEP
- DW3xx0 Chip Req's
  
  Supply 2.4 - 3.6 V
      ds #'s @ 3.0 V
  
          min typ max
  VDD1    1.6 3.0 3.6
  VDD2a,b 2.4 3.0 3.6
  VDD3    1.5 3.0 3.6
  
  Voltage on GPIO0-5,
  WAKEUP, RSTn, SPICSn,
  SPIMOSI, SPICLK
   -> Max: VDD1+0.3V
  
  I/O current (max): 10 mA
   VDD1 -> I/O
  
  Peak cont current
  is RX CH9: 88 mA
  
  TX worst-case:
   VDD2a/b: 20 mA
   VDD3: 20 mA
  
  RX worst-case:
   VDD2a/b: ~5 mA
   VDD3: ~70 mA
  
  Quiescent: 0.26 µA

## Sheet 5 of 5: External signals
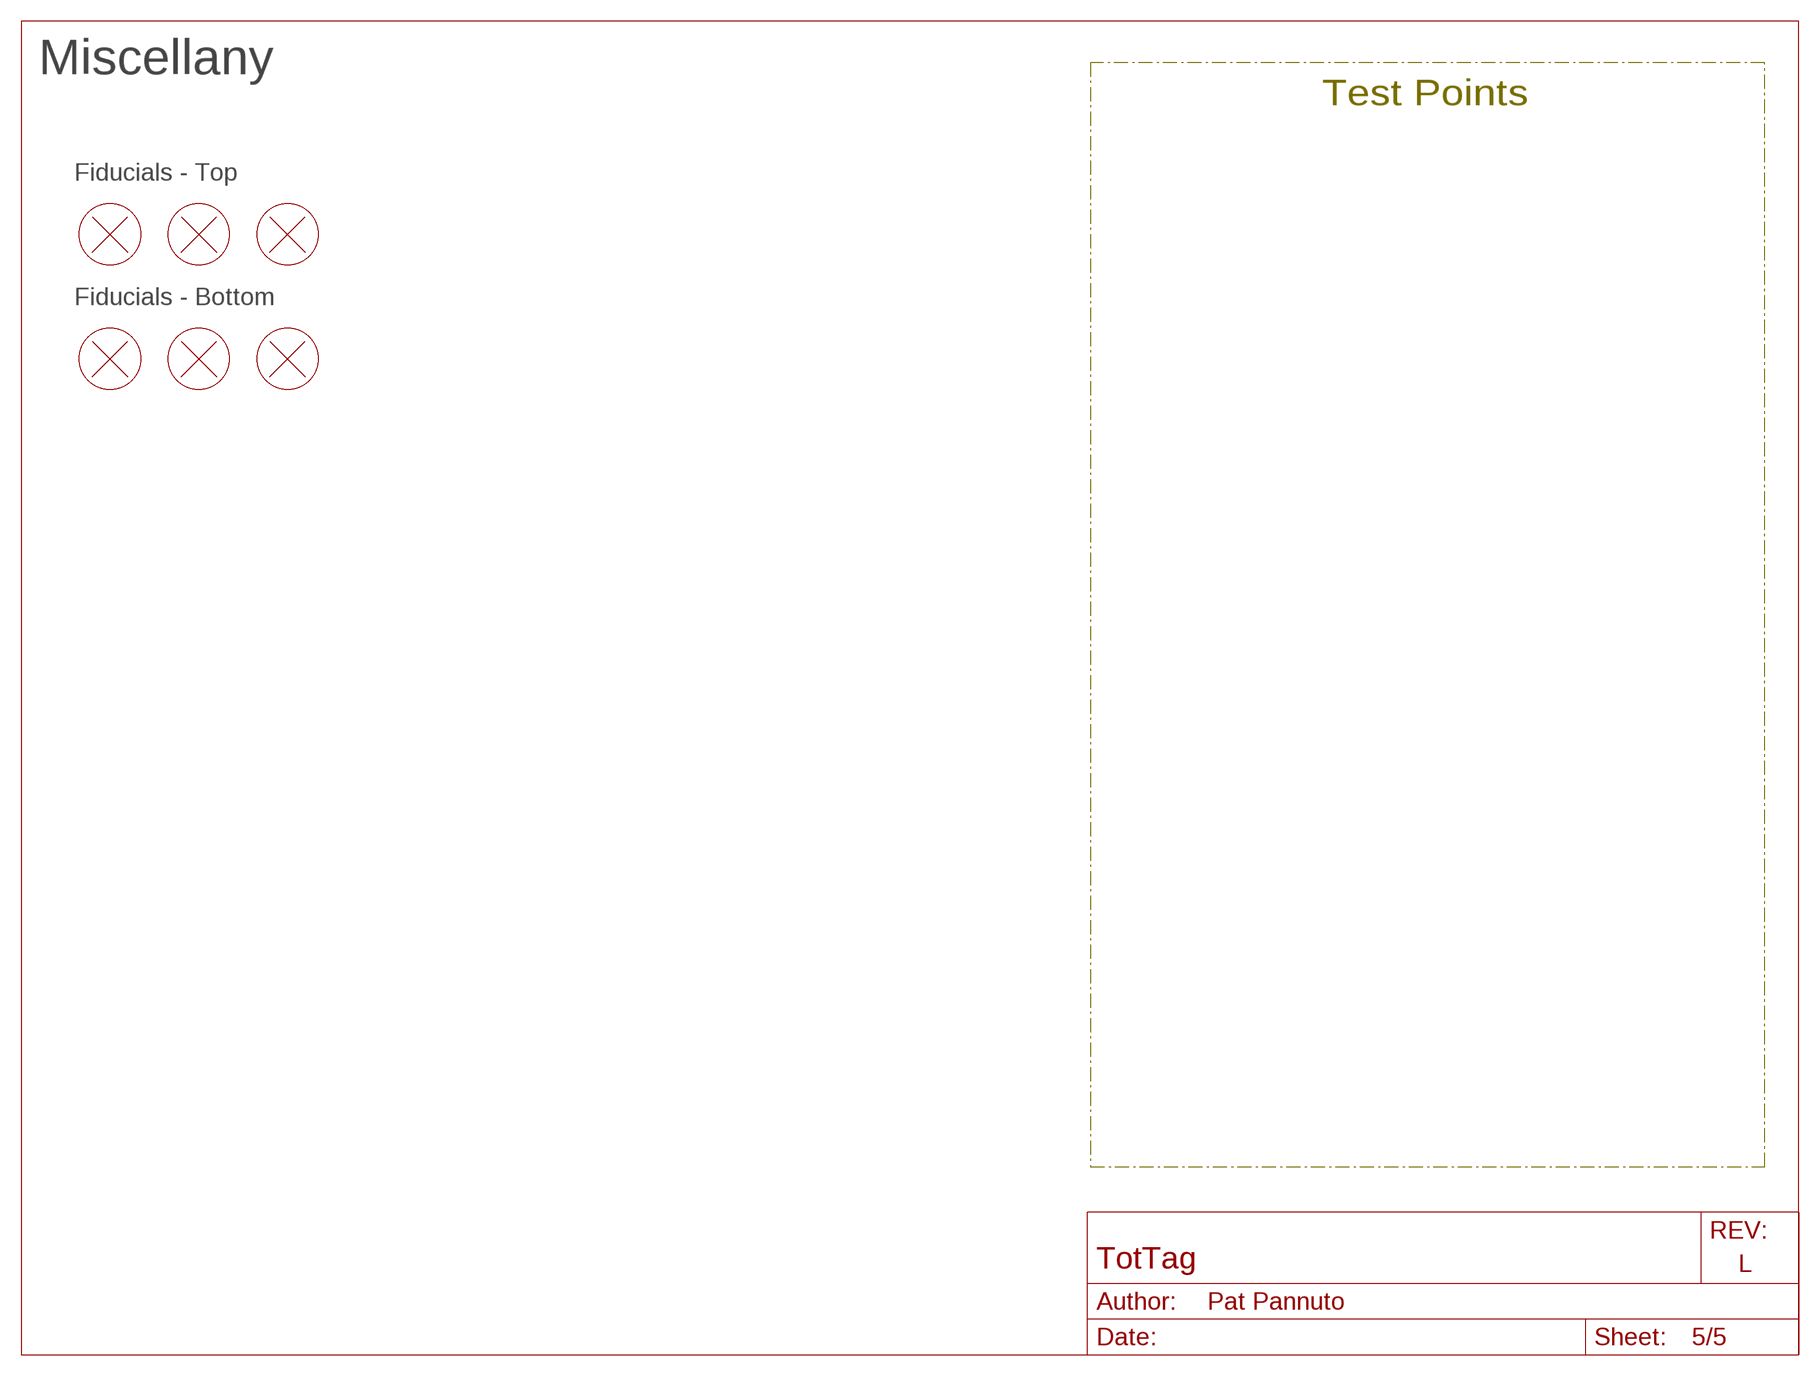
[diagram p4: schematic, sheet 5]

### Parts
FD1  FIDUCIAL  [FIDUCIAL_1MM-CU_2MM-MASK]
FD2  FIDUCIAL  [FIDUCIAL_1MM-CU_2MM-MASK]
FD3  FIDUCIAL  [FIDUCIAL_1MM-CU_2MM-MASK]
FD4  FIDUCIAL  [FIDUCIAL_1MM-CU_2MM-MASK]
FD5  FIDUCIAL  [FIDUCIAL_1MM-CU_2MM-MASK]
FD6  FIDUCIAL  [FIDUCIAL_1MM-CU_2MM-MASK]

### Notes on the sheet
- Miscellany
- Test Points
- Fiducials - Top
- Fiducials - Bottom

## Library data of the parts
A4 = antennas:AMCA72-2R47G-S1F-T: WiFi/Bluetooth/ZigBee, ISM Atenna Abracon Page <https://abracon.com/parametric/antennas/AMCA72-2R470G-S1F-T>; DESCRIPTION: RF ANT 2.4GHZ CHIP SOLDER SMD; DIGIKEY: 535-14108-1-ND; MPN: AMCA72-2R470G-S1F-T4
C1 = passives:CAPACITOR: SMD Capacitor; MPN: GJM1555C1HR50WB01D
C2 = passives:CAPACITOR: SMD Capacitor; MPN: GJM1555C1HR80WB01D
C5 C6 = passives:CAPACITOR: SMD Capacitor; MANUFACTURER: Murata; MPN: GRM0335C1H4R0BA01D
C7 C8 = passives:CAPACITOR: SMD Capacitor; MPN: GRM0335C1H220FA01D
C9 C10 = passives:CAPACITOR: SMD Capacitor; DESCRIPTION: CAP CER 470PF 50V C0G/NP0 0402; DIGIKEY: 490-6242-1-ND; MANUFACTURER: Murata; MPN: GRM1555C1H471JA01J
C15 C16 = passives:CAPACITOR: SMD Capacitor; DIGIKEY: 490-6351-2-ND; MPN: GRM155R71H103KA88J
C17-C19 = passives:CAPACITOR: SMD Capacitor; DIGIKEY: 490-10699-2-ND; MPN: GRM155R71E223JA61D
C20 C21 = passives:CAPACITOR: SMD Capacitor; DIGIKEY: 311-3823-1-ND; MPN: CC0402ZRY5V8BB223
C27-C30 = passives:CAPACITOR: SMD Capacitor; DIGIKEY: 490-6328-1-ND; MPN: GRM155R71C104KA88J
C31 C32 C35 = passives:CAPACITOR: SMD Capacitor; MPN: CL05A104KP5NNNC
C38 C39 = passives:CAPACITOR: SMD Capacitor; DIGIKEY: 490-12270-1-ND; MPN: GRT155R61E474ME01D
C41-C44 = passives:CAPACITOR: SMD Capacitor; MPN: GRM155R70J105KA12J
C45-C48 = passives:CAPACITOR: SMD Capacitor; APPLICATION: SMPS Filter; MPN: C1608X7S1A475K080AC
C53 C56 C57 = passives:CAPACITOR: SMD Capacitor; DIGIKEY: 1253-CM105X5R106M25ATCT-ND; MPN: CM105X5R106M25AT
D1 = leds:BICOLOR-SMD; MPN: MCL0606FRD1GR1T
D2 = leds:BICOLOR-SMD; MPN: MCL0606FYW1RD1T
D4 = passives:DIODE; DIGIKEY: 641-2087-1-ND; MPN: CDSQR400B-HF
FD1-FD6 = Quorvo:FIDUCIAL
J1 = connector:TC2030-JLINK
J4 = connector:MOLEX-PICO-SPOX-3: MOLEX 1.50mm Pitch, Pico-SPOX PCB Header, Single Row, Surface Mount. Default connector of Shenzhen LiPo + Thermistor suppliers ca. 2020.; DIGIKEY: WM7647CT-ND; MFN: 874380343
JP2 JP8 = SparkFun-Jumpers:JUMPER-SMT_3_1-NC_TRACE: Normally closed trace jumper (1 of 2 connections) This jumper has a trace between two pads so it's normally closed (NC). The other connection is normally open (NO). Use a razor knife to open the connection. For best results follow the IPC guidelines for cutting traces: Cutout at least 0.063 mm (0.005 in). Remove all loose material to clean up the cut area. Seal the cut with an approved epoxy. Reapply solder to reclose the connection, or to close the NO connection.
JP6 = SparkFun-Jumpers:JUMPER-SMT_2_NO: Normally open jumper This jumper has two pads in close proximity to each other. Apply solder to close the connection. Round pads are easier to solder for beginners, but are a lot larger. SparkFun Product that uses the round pads: SparkFun EL Sequencer <https://www.sparkfun.com/products/12781>
JP9 = pinhead:PINHD-1X2: PIN HEADER
JP10 JP11 = pinhead:PINHD-1X1: PIN HEADER
L1 L2 = passives:INDUCTOR: A very specific inductor; MANUFACTURER: TAIYO YUDEN; MPN: NR3015T100M
L3 = passives:INDUCTOR: A very specific inductor; MPN: LQW15AN4N7G8ZD
L4 = ac:WURTH_COIL_760308103204; DIGIKEY: 732-5258-ND; MANUFACTURER: Würth Elektronik; MPN: 760308103204
LS1 = audio:PUI_SMT-0440-T-2-R; DIGIKEY: 668-SMT-0440-T-2-RTR-ND; MPN: SMT-0440-T-2-R
Q2 = fets:MOSFET-NCHANNEL: Generic NMOS footprint; DIGIKEY: DMN2400UFB4-7DICT-ND
R1 R10 R24 R25 = passives:RESISTOR: Resistor Basic schematic elements and footprints for 0201, 0402, 0603, 1206, and PTH resistors.; MPN: RT0402BRE07100KL
R2 R3 = passives:RESISTOR: Resistor Basic schematic elements and footprints for 0201, 0402, 0603, 1206, and PTH resistors.; MPN: RC0402JR-075R1L
R4 R5 = passives:RESISTOR: Resistor Basic schematic elements and footprints for 0201, 0402, 0603, 1206, and PTH resistors.; MPN: RC0402JR-0715RL
R6 R7 = passives:RESISTOR: Resistor Basic schematic elements and footprints for 0201, 0402, 0603, 1206, and PTH resistors.; DIGIKEY: RMCF0402FT97R6CT-ND; MPN: RMCF0402FT97R6
R8 R9 = passives:RESISTOR: Resistor Basic schematic elements and footprints for 0201, 0402, 0603, 1206, and PTH resistors.; DIGIKEY: RMCF0402FT162RCT-ND; MPN: RMCF0402FT162R
R13 R14 RX5-RX8 = passives:RESISTOR: Resistor Basic schematic elements and footprints for 0201, 0402, 0603, 1206, and PTH resistors.
R15 = passives:RESISTOR: Resistor Basic schematic elements and footprints for 0201, 0402, 0603, 1206, and PTH resistors.; DIGIKEY: RMCF0402JT2K20CT-ND; MPN: RMCF0402JT2K20
R18 R20 R21 R23 XR19 = passives:RESISTOR: Resistor Basic schematic elements and footprints for 0201, 0402, 0603, 1206, and PTH resistors.; DIGIKEY: 311-10KJRCT-ND; MPN: RC0402JR-0710KL
R26 = passives:RESISTOR: Resistor Basic schematic elements and footprints for 0201, 0402, 0603, 1206, and PTH resistors.; MPN: ERJ-1GNF2613C
R27 = passives:RESISTOR: Resistor Basic schematic elements and footprints for 0201, 0402, 0603, 1206, and PTH resistors.; MPN: ERJ-1GNF4023C
R28 R29 = passives:RESISTOR: Resistor Basic schematic elements and footprints for 0201, 0402, 0603, 1206, and PTH resistors.; MPN: ERJ-1GNF8453C
R30 = passives:RESISTOR: Resistor Basic schematic elements and footprints for 0201, 0402, 0603, 1206, and PTH resistors.; MPN: RMCF0402FT1M87; TOLERANCE: 1%
R31 = passives:RESISTOR: Resistor Basic schematic elements and footprints for 0201, 0402, 0603, 1206, and PTH resistors.; DIGIKEY: RMCF0402FT5M10CT-ND; MPN: RMCF0402FT5M10; TOLERANCE: 1%
RT1 = passives:THERMISTOR: Thermistor. Temperature-controller resistor.; DIGIKEY: 490-18149-1-ND; MPN: NCU15XH103F60RC
RZ1-RZ7 = passives:RESISTOR: Resistor Basic schematic elements and footprints for 0201, 0402, 0603, 1206, and PTH resistors.; CAN_SUBSTITUE: YES; MPN: RMCF0603ZT0R00
S1 = Wurth_Switch_WS-SLSU:450404015514: WS-SLSU Mini Slide Switch, Same Side Connection Side Push 6.7x2.7 mm Properties Actuator Material:PA46 Actuator Flammability Rating:UL94 HB Actuator Color:Black Frame Material:LCP Frame Flammability Rating:UL94 V-0 Frame Color:Black Contact Material:Copper Alloy Contact Plating:Silver Terminal Material:Copper Alloy Terminal Plating:Silver Switching Function:On-On Schematic:SPDT Connection Type:Same Side Connection Qty.:3300 Material Properties Cover Material:Stainless Steel General Information Operating Temperature:-40 up to +85 °C Packaging Properties Packaging :Tape and Reel <https://www.we-online.com/catalog/media/o76706v209%20Family_WS-SLSU_Gruppe.jpg> Details see: https://www.we-online.com/catalog/en/SLSU_6_7X_2_7_SMD_HORIZONTAL/ Updated by yingchun,Shan;2020-02-25 2020(C) Würth Elektronik; DATASHEET-URL: https://www.we-online.com/catalog/datasheet/450404015514.pdf; DIGIKEY: 732-13665-1-ND; IR: 300mA; PACKAGING: Tape and Reel; PART-NUMBER: 450404015514; QTY: 150; VR: 5V(DC)
U3 = chips:BQ24040: Simple Li Ion / Li Poly charger.; DIGIKEY: 296-37142-1-ND; MPN: BQ24040DSQR
U4 = chips:BQ51013B: bq51013B Highly Integrated Wireless Receiver Qi (WPC v1.2) Compliant Power Supply; DIGIKEY: 296-38885-1-ND; MPN: BQ51013BRHLR
U5 = Quorvo:W25N01GWZEIG; MANUFACTURER: Winbond; MPN: W25N01GWZEIG
U6 = Quorvo:BNO055; MANUFACTURER: Bosch Scientific; MPN: BNO055
VR1 = regulators:RT8020; MANUFACTURER: RichTek; MPN: RT8020GQW
X2 = crystals:TXC-9HT12; C-LOAD: 7pF; FREQUENCY: 32.768 kHz; MANUFACTURER: TXC Corp; MPN: 9HT12-32.768KDZY-T
XA1-XA3 = Quorvo:DWM3000
XA4 = Quorvo:APOLLO4_BLUEPLUS_MODULE

## Net classes
1 BLE_RF: width 0.356 mm, clearance 0.254 mm
2 UWB_RF: width 0.356 mm, clearance 0.254 mm